# EAGLE design Un_AVR_V2.0 (EAGLE 6.5.0)
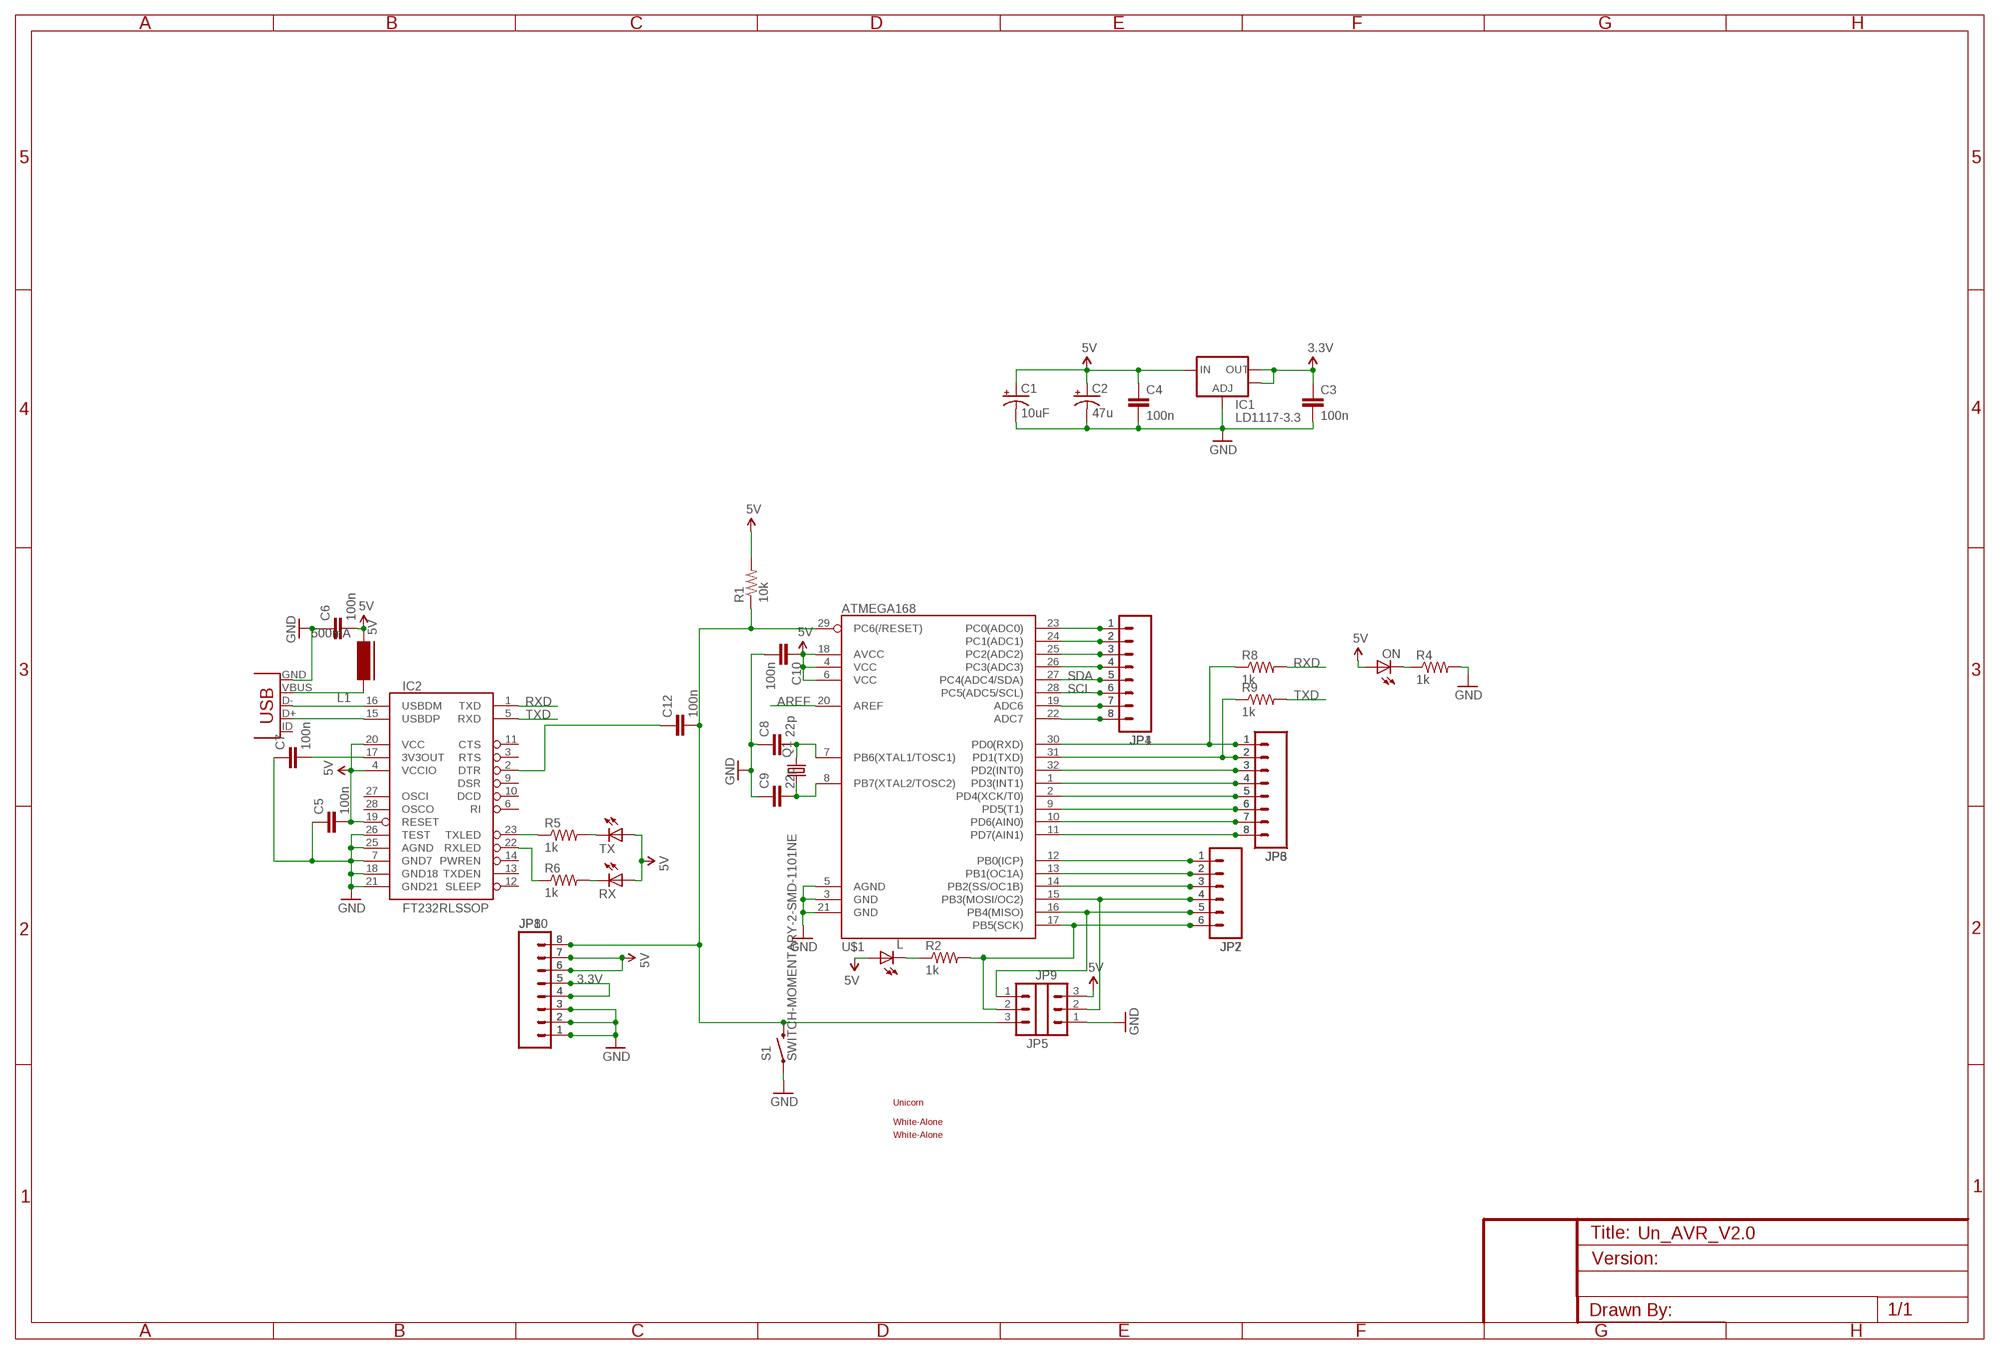
[diagram p0: schematic, sheet 1]

## Parts
C1  10uF  CAP_POL1206  [EIA3216]
C2  47u  CAP_POLD  [PANASONIC_D]
C3  100n  CAP0603-CAP  [0603-CAP]
C4  100n  CAP0603-CAP  [0603-CAP]
C5  100n  CAP0603-CAP  [0603-CAP]
C6  100n  CAP0603-CAP  [0603-CAP]
C7  100n  CAP0603-CAP  [0603-CAP]
C8  22p  CAP0603-CAP  [0603-CAP]
C9  22p  CAP0603-CAP  [0603-CAP]
C10  100n  CAP0603-CAP  [0603-CAP]
C12  100n  CAP0603-CAP  [0603-CAP]
IC1  LD1117-3.3  V_REG_LM1117SOT223  [SOT223]
IC2  FT232RLSSOP  [SSOP28DB]
JP1  M081X08  [1X08]
JP2  M06SIP  [1X06]
JP3  M08  [1X08]
JP4  M081X08  [1X08]
JP5  M03PTH  [1X03]
JP6  M08  [1X08]
JP7  M06SIP  [1X06]
JP8  M08  [1X08]
JP9  M03PTH  [1X03]
JP10  M08  [1X08]
L  LED0805  [LED-0805]
L1  500mA  FERRITE-0805  [FB805]
ON  LED0805  [LED-0805]
Q1  CRYSTALHC49US  [HC49US]
R1  10k  RESISTOR0603-RES  [0603-RES]
R2  1k  RESISTOR0603-RES  [0603-RES]
R4  1k  RESISTOR0603-RES  [0603-RES]
R5  1k  RESISTOR0603-RES  [0603-RES]
R6  1k  RESISTOR0603-RES  [0603-RES]
R8  1k  RESISTOR0603-RES  [0603-RES]
R9  1k  RESISTOR0603-RES  [0603-RES]
RX  LED0805  [LED-0805]
S1  SWITCH-MOMENTARY-2-SMD-1101NE  [TACTILE-SWITCH-1101NE]
TX  LED0805  [LED-0805]
U$1  ATMEGA168  [TQFP32-08]
U$4  UNICORN_1  [UNICORN_1]
U$13  WHITE-ALONE_0  [WHITE-ALONE_0]
U$14  WHITE-ALONE_0  [WHITE-ALONE_0]
U$16  USB_5-SMD  [USB-MINIB]

## Nets
3.3V: C3.1 IC1.2(OUT) IC1.4(OUT) JP8.4 JP8.5 JP10.4 JP10.5
5V: C1.A(+) C2.+ C4.1 C5.2 C6.2 C10.1 IC1.3(IN) IC2.4(VCCIO) IC2.19(RESET) IC2.20(VCC) JP8.6 JP8.7 JP9.3 JP10.6 JP10.7 L1.2 L.1(A) ON.1(A) R1.2 RX.1(A) TX.1(A) U$1.4(VCC) U$1.6(VCC) U$1.18(AVCC)
A0: JP1.1 JP4.1 U$1.23(PC0(ADC0))
AREF: U$1.20(AREF)
GND: C1.C(-) C2.- C3.2 C4.2 C5.1 C6.1 C7.1 C8.1 C9.1 C10.2 IC1.1(ADJ) IC2.7(GND7) IC2.18(GND18) IC2.21(GND21) IC2.25(AGND) IC2.26(TEST) JP8.1 JP8.2 JP8.3 JP9.1 JP10.1 JP10.2 JP10.3 R4.2 S1.P$1 U$1.3(GND) U$1.5(AGND) U$1.21(GND) U$16.GND
IO0: JP3.1 JP6.1 R8.1 U$1.30(PD0(RXD))
N$1: C7.2 IC2.17(3V3OUT)
N$2: IC2.23(TXLED) R5.1
N$3: L1.1 U$16.VBUS
N$4: R5.2 TX.2(C)
N$5: IC2.16(USBDM) U$16.D-
N$6: IC2.15(USBDP) U$16.D+
N$7: R6.2 RX.2(C)
N$8: ON.2(C) R4.1
N$9: L.2(C) R2.1
N$10: IC2.22(RXLED) R6.1
N$12: JP1.7 JP4.7 U$1.19(ADC6)
N$13: JP1.8 JP4.8 U$1.22(ADC7)
N$14: C12.2 JP5.3 JP8.8 JP10.8 R1.1 S1.P$2 U$1.29(PC6(/RESET))
N$15: C12.1 IC2.2(DTR)
N$16: JP2.1 JP7.1 U$1.12(PB0(ICP))
N$17: JP2.2 JP7.2 U$1.13(PB1(OC1A))
N$18: JP2.3 JP7.3 U$1.14(PB2(SS/OC1B))
N$19: JP2.4 JP7.4 JP9.2 U$1.15(PB3(MOSI/OC2))
N$20: JP2.5 JP5.1 JP7.5 U$1.16(PB4(MISO))
N$23: JP3.2 JP6.2 R9.1 U$1.31(PD1(TXD))
N$24: JP3.3 JP6.3 U$1.32(PD2(INT0))
N$25: JP3.4 JP6.4 U$1.1(PD3(INT1))
N$26: JP3.5 JP6.5 U$1.2(PD4(XCK/T0))
N$27: JP3.6 JP6.6 U$1.9(PD5(T1))
N$28: JP3.7 JP6.7 U$1.10(PD6(AIN0))
N$29: JP3.8 JP6.8 U$1.11(PD7(AIN1))
N$31: JP1.2 JP4.2 U$1.24(PC1(ADC1))
N$32: JP1.3 JP4.3 U$1.25(PC2(ADC2))
N$33: JP1.4 JP4.4 U$1.26(PC3(ADC3))
N$39: C8.2 Q1.2 U$1.7(PB6(XTAL1/TOSC1))
N$40: C9.2 Q1.1 U$1.8(PB7(XTAL2/TOSC2))
RXD: IC2.1(TXD) R8.2
SCK: JP2.6 JP5.2 JP7.6 R2.2 U$1.17(PB5(SCK))
SCL: JP1.6 JP4.6 U$1.28(PC5(ADC5/SCL))
SDA: JP1.5 JP4.5 U$1.27(PC4(ADC4/SDA))
TXD: IC2.5(RXD) R9.2
Unconnected: IC2.3(RTS) IC2.6(RI) IC2.9(DSR) IC2.10(DCD) IC2.11(CTS) IC2.12(SLEEP) IC2.13(TXDEN) IC2.14(PWREN) IC2.27(OSCI) IC2.28(OSCO) U$16.ID(USBID)

## Library data of the parts
C1 C2 = 2SparkFun:CAP_POL: Capacitor Polarized These are standard SMD and PTH capacitors. Normally 10uF, 47uF, and 100uF in electrolytic and tantalum varieties. Always verify the external diameter of the through hole cap, it varies with capacity, voltage, and manufacturer. The EIA devices should be standard.
C3-C10 = 2SparkFun:CAP: Capacitor Standard 0603 ceramic capacitor, and 0.1" leaded capacitor.
C12 = 1SparkFun:CAP: Capacitor Standard 0603 ceramic capacitor, and 0.1" leaded capacitor.
IC1 = 1SparkFun:V_REG_LM1117: Voltage Regulator LM1117 Standard adjustable voltage regulator but in SMD form. Spark Fun Electronics SKU : COM-00595
IC2 = 1SparkFun:FT232RL: USB UART FT232RL 4th Generation USB UART (USB <-> Serial) Controller. Spark Fun Electronics SKU : COM-00650
JP1 JP4 = 2SparkFun:M08: Header 8 Standard 8-pin 0.1" header. Use with straight break away headers (SKU : PRT-00116), right angle break away headers (PRT-00553), swiss pins (PRT-00743), machine pins (PRT-00117), and female headers (PRT-00115).
JP2 JP7 = 2SparkFun:M06: Header 6 Standard 6-pin 0.1" header. Use with straight break away headers (SKU : PRT-00116), right angle break away headers (PRT-00553), swiss pins (PRT-00743), machine pins (PRT-00117), and female headers (PRT-00115). Molex polarized connector foot print use with SKU : PRT-08094 with associated crimp pins and housings. NOTES ON THE VARIANTS LOCK and LOCK_LONGPADS... This footprint was designed to help hold the alignment of a through-hole component (i.e. 6-pin header) while soldering it into place. You may notice that each hole has been shifted either up or down by 0.005 of an inch from it's more standard position (which is a perfectly straight line). This slight alteration caused the pins (the squares in the middle) to touch the edges of the holes. Because they are alternating, it causes a "brace" to hold the component in place. 0.005 has proven to be the perfect amount of "off-center" position when using our standard breakaway headers. Although looks a little odd when you look at the bare footprint, once you have a header in there, the alteration is very hard to notice. Also, if you push a header all the way into place, it is covered up entirely on the bottom side. This idea of altering the position of holes to aid alignment will be further integrated into the Sparkfun Library for other footprints. It can help hold any component with 3 or more connection pins.
JP3 JP6 JP8 JP10 = 1SparkFun:M08: Header 8 Standard 8-pin 0.1" header. Use with straight break away headers (SKU : PRT-00116), right angle break away headers (PRT-00553), swiss pins (PRT-00743), machine pins (PRT-00117), and female headers (PRT-00115).
JP5 JP9 = 0SparkFun:M03: Header 3 Standard 3-pin 0.1" header. Use with straight break away headers (SKU : PRT-00116), right angle break away headers (PRT-00553), swiss pins (PRT-00743), machine pins (PRT-00117), and female headers (PRT-00115). Molex polarized connector foot print use with SKU : PRT-08232 with associated crimp pins and housings.
L ON RX TX = 1SparkFun:LED: LEDs Standard schematic elements and footprints for 5mm, 3mm, 1206, and 0603 sized LEDs. 5mm - Spark Fun Electronics SKU : COM-00529 (and others)
L1 = 2SparkFun:FERRITE: Ferrite bead in various packages
Q1 = 1SparkFun:CRYSTAL: Crystals Various standard crystals. Proven footprints. Spark Fun Electronics SKU : COM-00534
R1 R2 R4-R6 R8 R9 = 2SparkFun:RESISTOR: Resistor Basic schematic elements and footprints for 0603, 1206, and PTH resistors.
S1 = 2SparkFun:SWITCH-MOMENTARY-2
U$1 = 1SparkFun:ATMEGA168
U$4 = 2SparkFun:UNICORN
U$13 U$14 = 2SparkFun:WHITE-ALONE
U$16 = 2SparkFun:USB_5

## Net classes
0 default: width 0.254 mm, clearance 0.254 mm
1 power: width 0.61 mm, drill 0.61 mm, clearance 0.254 mm
2 gnd: width 0.305 mm, drill 0.559 mm, clearance 0.254 mm
3 usbvcc: width 0.508 mm, drill 0.61 mm, clearance 0.254 mm
4 aref: width 0.406 mm, drill 0.61 mm, clearance 0.254 mm

## Board
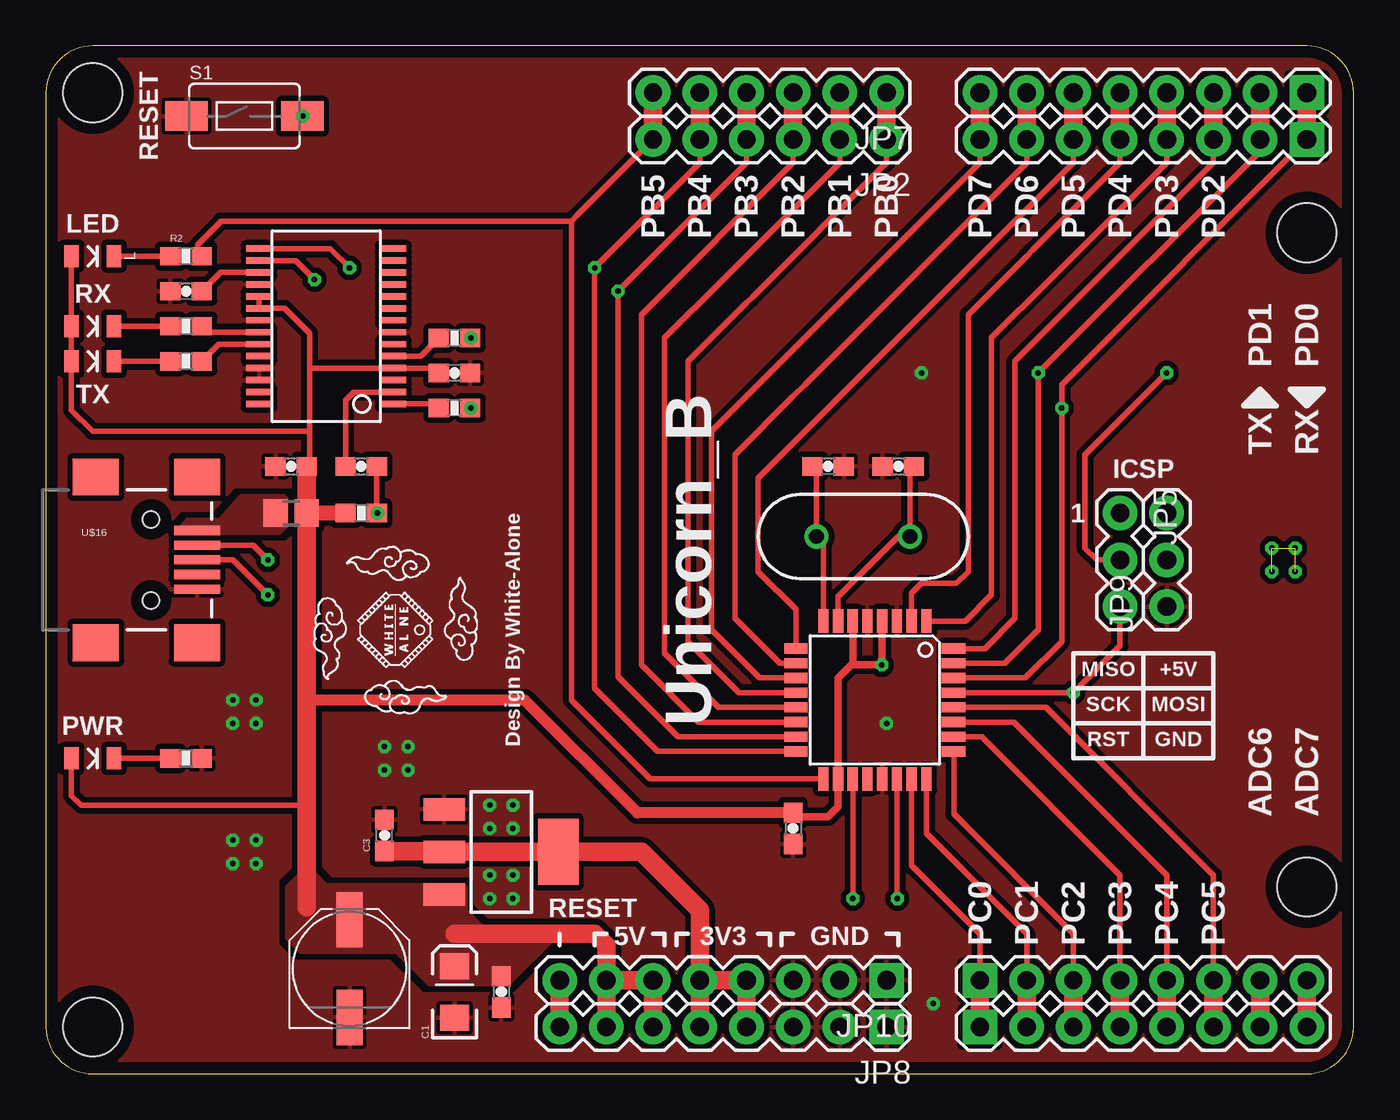
[diagram p1: board, top side]
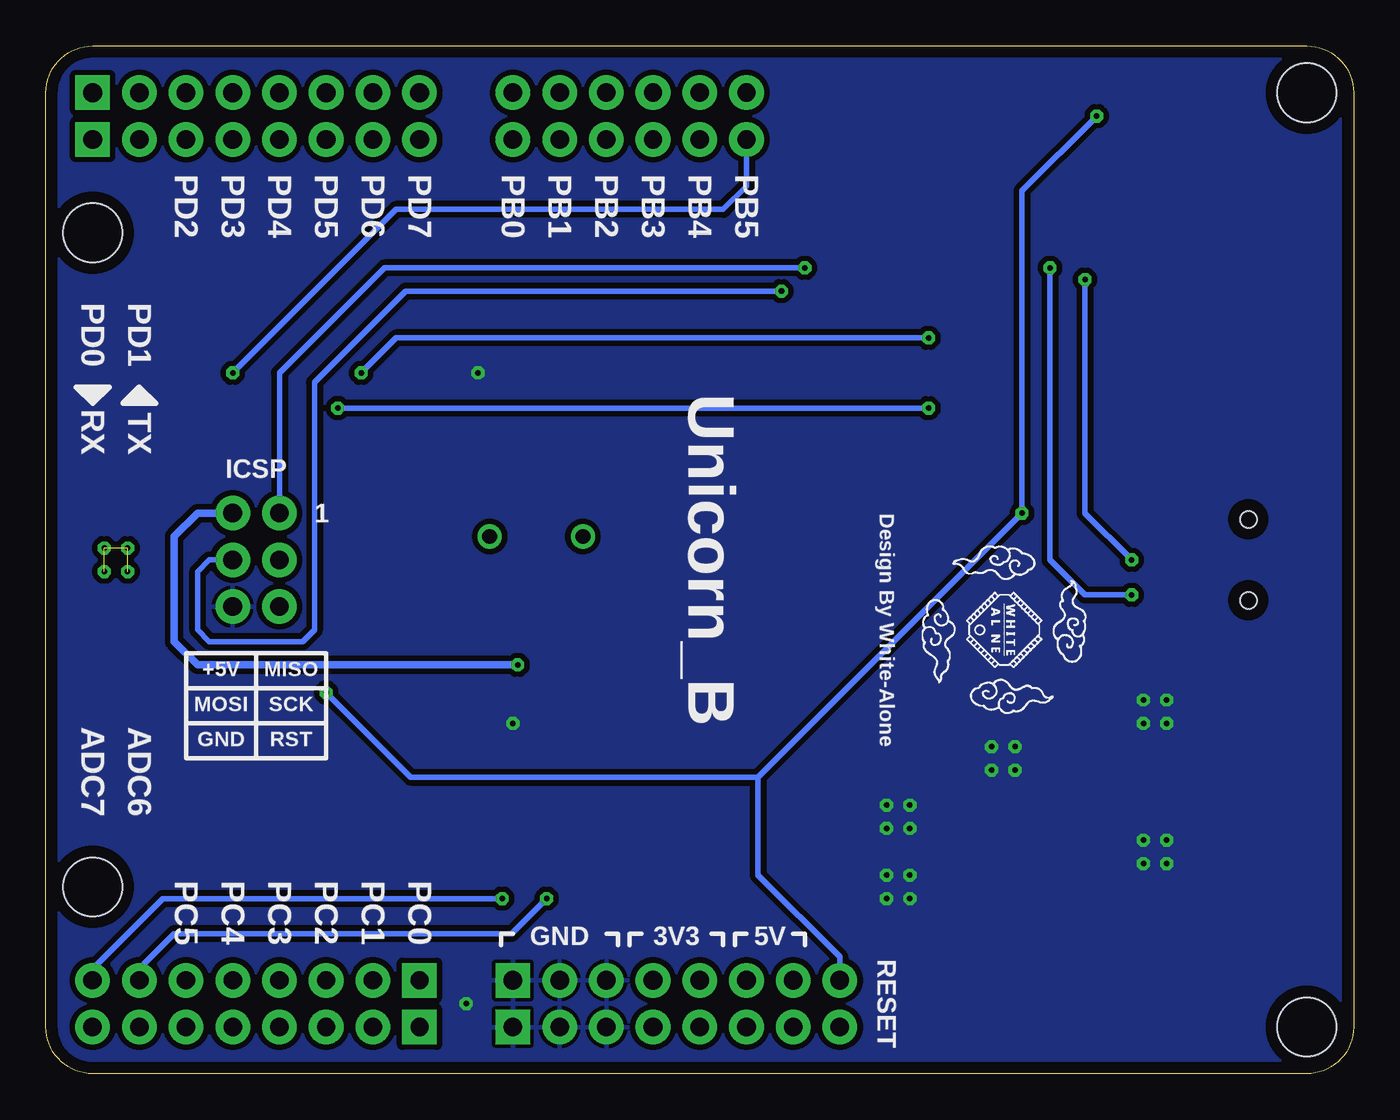
[diagram p2: board, bottom side, seen from below]

Size 71.12 x 55.88 mm. Coordinates in mm from the lower left corner, seen from the top.
Copper layers (1*16): Top 0.035mm / dielectric 1.5mm / Bottom 0.035mm
Design rules "yun": minimum track width 8mil, minimum drill 15mil, track to track 8mil, track to pad 8mil, pad to pad 8mil, via to via 8mil, smd to smd 8mil, copper to edge 25mil, drill to drill 8mil, minimum pad ring 10mil, minimum via ring 8mil, stop-mask expansion 4mil, vias tented up to drill 20mil, thermal gap 8mil

### Footprints (pad centres in the part's own frame; a part is rotated, then mirrored left to right if it is on the bottom)
EIA3216 = smd 1.4 x 1.6: A 1.4,0; C -1.4,0
PANASONIC_D = smd 3 x 1.4: + 2.654,0; - -2.654,0
0603-CAP = smd 1.1 x 1: 1 -0.85,0; 2 0.85,0
SOT223 = smd 1.219 x 2.235: 1 -2.311,-3.099; 2 0,-3.099; 3 2.311,-3.099 | smd 3.6 x 2.2: 4 0,3.099
SSOP28DB = smd 0.348 x 1.397: 1 -4.225,-3.656; 2 -3.575,-3.656; 3 -2.925,-3.656; 4 -2.275,-3.656; 5 -1.625,-3.656; 6 -0.975,-3.656; 7 -0.325,-3.656; 8 0.325,-3.656; 9 0.975,-3.656; 10 1.625,-3.656; 11 2.275,-3.656; 12 2.925,-3.656; 13 3.575,-3.656; 14 4.225,-3.656; 15 4.225,3.656; 16 3.575,3.656; 17 2.925,3.656; 18 2.275,3.656; 19 1.625,3.656; 20 0.975,3.656; 21 0.325,3.656; 22 -0.325,3.656; 23 -0.975,3.656; 24 -1.625,3.656; 25 -2.275,3.656; 26 -2.925,3.656; 27 -3.575,3.656; 28 -4.225,3.656
1X08 = drill 1 pad 1.88 square: 1 0,0 | drill 1 pad 1.88: 2 2.54,0; 3 5.08,0; 4 7.62,0; 5 10.16,0; 6 12.7,0; 7 15.24,0; 8 17.78,0
1X06 = drill 1 pad 1.88: 1 0,0; 2 2.54,0; 3 5.08,0; 4 7.62,0; 5 10.16,0; 6 12.7,0
1X08' = drill 1.016 pad 1.88 square: 1 0,0 | drill 1.016 pad 1.88: 2 2.54,0; 3 5.08,0; 4 7.62,0; 5 10.16,0; 6 12.7,0; 7 15.24,0; 8 17.78,0
1X03 = drill 1.016 pad 1.88: 1 0,0; 2 2.54,0; 3 5.08,0
LED-0805 = smd 0.8 x 1.2: 1 -1.154,0; 2 1.154,0
FB805 = smd 1.3 x 1.5: 1 -0.85,0; 2 0.85,0
HC49US = drill 0.813: 1 -2.54,0; 2 2.54,0
0603-RES = smd 1.1 x 1: 1 -0.85,0; 2 0.85,0
TACTILE-SWITCH-1101NE = smd 2.3 x 1.6: P$1 -3.15,0; P$2 3.15,0
TQFP32-08 = smd 1.27 x 0.559: 1 -4.293,2.8; 2 -4.293,2; 3 -4.293,1.2; 4 -4.293,0.4; 5 -4.293,-0.4; 6 -4.293,-1.2; 7 -4.293,-2; 8 -4.293,-2.8; 17 4.293,-2.8; 18 4.293,-2; 19 4.293,-1.2; 20 4.293,-0.4; 21 4.293,0.4; 22 4.293,1.2; 23 4.293,2; 24 4.293,2.8 | smd 0.559 x 1.27: 9 -2.8,-4.293; 10 -2,-4.293; 11 -1.2,-4.293; 12 -0.4,-4.293; 13 0.4,-4.293; 14 1.2,-4.293; 15 2,-4.293; 16 2.8,-4.293; 25 2.8,4.293; 26 2,4.293; 27 1.2,4.293; 28 0.4,4.293; 29 -0.4,4.293; 30 -1.2,4.293; 31 -2,4.293; 32 -2.8,4.293
UNICORN_1 = hole 3.2: -33.02,-25.4; 33.02,17.78; 33.02,-17.78; -33.02,25.4
USB-MINIB = smd 2.5 x 0.5: D+ 2.5,0; D- 2.5,0.8; GND 2.5,-1.6; ID 2.5,-0.8; VBUS 2.5,1.6 | smd 2.5 x 2: MTN1 -3,4.5; MTN2 2.5,4.5; MTN3 -3,-4.5; MTN4 2.5,-4.5 | hole 0.9: 0,2.2; 0,-2.2

### Placement (x,y rotation side)
C1  22.23,4.45 90 top
C2  16.51,5.71 90 top
C3  18.41,12.95 90 top
C4  24.77,4.45 270 top
C5  22.23,38.1 180 top
C6  13.34,33.02 0 top
C7  7.62,42.55 0 top
C8  46.35,33.02 0 top
C9  42.55,33.02 180 top
C10  40.64,13.34 270 top
C12  17.14,33.02 0 top
IC1  24.77,12.06 270 top
IC2  15.24,40.64 90 top
JP1  50.8,5.08 0 top
JP2  45.72,50.8 180 top
JP3  [1X08']  68.58,53.34 180 top
JP4  50.8,2.54 0 top
JP5  58.42,30.48 270 top
JP6  [1X08']  68.58,50.8 180 top
JP7  45.72,53.34 180 top
JP8  [1X08']  45.72,2.54 180 top
JP9  60.96,25.4 90 top
JP10  [1X08']  45.72,5.08 180 top
L  2.54,44.45 0 top
L1  13.34,30.48 0 top
ON  2.54,17.14 0 top
Q1  44.45,29.21 0 top
R1  17.14,30.48 180 top
R2  7.62,44.45 0 top
R4  7.62,17.14 0 top
R5  7.62,38.73 180 top
R6  7.62,40.64 180 top
R8  22.23,36.2 180 top
R9  22.23,40.01 180 top
RX  2.54,40.64 0 top
S1  10.79,52.07 0 top
TX  2.54,38.73 0 top
U$1  45.09,20.32 270 top
U$4  35.56,27.94 0 top
U$13  19.05,24.13 90 top
U$14  19.05,24.13 270 bottom
U$16  5.71,27.94 0 top

### Tracks (layer width: path | path; a pad name or v marks a point on that pad's centre or on a via)
3.3V
  Top 1.016: C3.1 22.26,12.1 IC1.2 IC1.4 32.38,12.06 35.56,8.89 JP10.5 | JP8.5 JP10.5 | JP8.4 JP10.4 JP10.5
5V  (via drill 0.3)
  Top 0.305: 45.47,24.64 45.47,24.51 45.48,24.53 U$1.4 | C6.2 14.34,33.17 14.34,34.92 | IC2.19 IC2.20 12.99,41.62 14.34,40.27 14.34,38.37 | ON.1 1.39,15.12 1.91,14.61 14.19,14.61 | L.1 RX.1 TX.1 1.39,36.08 2.54,34.92 14.34,34.92 | 14.34,34.92 14.34,38.37 | 14.34,38.37 IC2.4 21.11,38.37 C5.2
  Top 0.406: 45.47,24.51 v45.47,22.23 43.81,22.23 | 43.81,22.23 43.09,21.5 U$1.18 43.09,14.51 42.55,13.97 40.85,13.97 C10.1 | U$1.6 43.88,22.3 43.81,22.23
  Top 0.61: 14.19,20.32 26.04,20.32 32.17,14.19 C10.1
  Top 0.813: R1.2 L1.2
  Top 1.016: C6.2 L1.2 14.19,20.32 14.19,14.61 14.19,9.06 | JP8.6 JP10.6 JP10.7 | JP10.7 JP8.7 | JP10.7 30.48,6.99 29.84,7.62 22.23,7.62
  Bottom 0.406: v45.47,22.23 62.87,22.23 64.14,23.5 64.14,29.21 62.87,30.48 JP9.3
  pour Top (no thermals): 13.08,7.37 13.84,6.6 19.05,6.6 20.83,4.83 25.15,4.83 27.81,7.49 27.81,8 23.75,8 22.86,8.89 22.86,10.16 22.73,10.29 15.24,10.29 14.61,10.92 13.84,10.92 13.08,10.16
A0
  Top 0.305: U$1.23 47.09,11.34 50.8,7.62 JP1.1
  Top 1.016: JP1.1 JP4.1
GND  (via drill 0.3)
  other vias: 45.72,19.05 48.26,3.81 24.13,10.79 25.4,10.79 25.4,13.34 25.4,14.61 10.16,20.32 11.43,20.32 11.43,19.05 10.16,19.05 18.41,16.51 19.68,16.51 19.68,17.78 18.41,17.78 10.16,12.7 11.43,12.7 10.16,11.43 11.43,11.43 24.13,9.53 25.4,9.53 24.13,13.34 24.13,14.61 47.62,38.1
  pour Top (isolate 0.305, rank 2): 0,55.88 71.12,55.88 71.12,0 0,0
  pour Bottom (isolate 0.305, rank 2): 0,55.88 71.12,55.88 71.12,0 0,0
GND1  (via drill 0.3)  (3 unrouted)
  other vias: 66.67,27.3 67.94,27.3 67.94,28.57 66.67,28.57
IO0  (via drill 0.3)
  Top 0.305: R8.1 v23.11,36.2 | JP6.1 55.24,37.47 v55.24,36.2 55.24,23.5 53.27,21.52 U$1.30
  Top 1.016: JP3.1 JP6.1
  Bottom 0.305: v23.11,36.2 v55.24,36.2
N$1
  Top 0.305: IC2.17 9.49,43.56 C7.2
N$2
  Top 0.305: IC2.23 9.4,39.66 R5.1
N$3
  pour Top (no thermals): 7.42,29.39 12.7,29.39 13.08,29.77 13.08,31.29 12.95,31.42 10.59,31.42 9.45,30.15 7.67,30.15 7.29,29.72 7.29,29.46
N$4
  Top 0.305: TX.2 R5.2
N$5  (via drill 0.3)
  Top 0.305: IC2.16 13.57,44.22 v14.61,43.18 | v12.06,27.94 11.27,28.74 U$16.D-
  Bottom 0.305: v14.61,43.18 14.61,30.48 v12.06,27.94
N$6  (via drill 0.3)
  Top 0.305: U$16.D+ 10.16,27.94 v12.06,26.04 | IC2.15 15.46,44.87 v16.51,43.81
  Bottom 0.305: v16.51,43.81 16.51,27.94 14.61,26.04 v12.06,26.04
N$7
  Top 0.305: RX.2 R6.2
N$8
  Top 0.305: ON.2 R4.1
N$9
  Top 0.305: L.2 R2.1
N$10
  Top 0.305: IC2.22 8.79,40.31 R6.1
N$12  (via drill 0.3)
  Top 0.305: U$1.19 v43.88,9.53 v43.89,9.53
  Top 1.016: JP1.7 JP4.7
  Bottom 0.305: v43.89,9.53 45.8,7.62 64.14,7.62 66.04,5.71 JP1.7
N$13  (via drill 0.3)
  Top 0.305: U$1.22 46.28,9.54 v46.3,9.53
  Top 1.016: JP1.8 JP4.8
  Bottom 0.305: v46.3,9.53 64.77,9.53 68.58,5.71 JP1.8
N$14  (via drill 0.3)
  Top 0.305: C12.2 R1.1 v18.03,30.48 | U$1.29 v55.88,20.72 58.42,23.26 JP5.3 | S1.P$2 v13.97,52.07
  Top 1.016: JP8.8 JP10.8
  Bottom 0.305: JP10.8 27.94,6.35 32.38,10.79 32.38,16.13 | 32.38,16.13 v18.03,30.48 18.03,48.01 v13.97,52.07 | v55.88,20.72 51.29,16.13 32.38,16.13
N$15
  Top 0.305: C12.1 16.3,36.62 16.75,37.06 IC2.2
N$16
  Top 0.305: 40.88,20.72 U$1.12 37.7,20.72 34.92,23.5 34.92,38.73 38.1,41.91 38.42,42.23 45.72,49.53 JP2.1
  Top 1.016: JP7.1 JP2.1
N$17
  Top 0.305: U$1.13 40.77,19.94 36.58,19.94 33.66,22.86 33.66,40.01 36.83,43.18 37.15,43.5 43.18,49.53 JP2.2
  Top 1.016: JP7.2 JP2.2
N$18
  Top 0.305: JP2.3 40.64,49.53 32.38,41.27 32.38,22.23 35.49,19.12 U$1.14
  Top 1.016: JP7.3 JP2.3
N$19  (via drill 0.3)
  Top 0.305: JP2.4 38.1,49.53 v31.11,42.55 31.11,21.59 34.38,18.32 U$1.15
  Top 1.016: JP7.4 JP2.4
  Bottom 0.305: v31.11,42.55 51.55,42.56 56.52,37.59 56.52,24.13 57.15,23.5 62.23,23.5 62.87,24.13 62.87,27.3 62.23,27.94 JP9.2
N$20  (via drill 0.3)
  Top 0.305: 40.79,17.5 40.77,17.53 33.27,17.53 29.84,20.95 v29.84,43.81 35.56,49.53 JP2.5 | U$1.16 40.79,17.5 | 40.79,17.5 40.89,17.4
  Top 1.016: JP7.5 JP2.5
  Bottom 0.305: v29.84,43.81 52.7,43.81 58.42,38.1 JP5.1
N$23  (via drill 0.3)
  Top 0.305: R9.1 v23.11,40.01 | JP6.2 66.04,50.16 v53.98,38.1 53.98,24.13 52.16,22.32 U$1.31
  Top 1.016: JP3.2 JP6.2
  Bottom 0.305: v23.11,40.01 52.07,40.01 v53.98,38.1
N$24
  Top 0.305: U$1.32 51.06,23.12 52.7,24.77 52.7,38.73 63.5,49.53 JP6.3
  Top 1.016: JP3.3 JP6.3
N$25
  Top 0.305: U$1.1 50.01,24.61 51.44,26.04 51.44,40.01 54.61,43.18 54.93,43.5 60.96,49.53 JP6.4
  Top 1.016: JP3.4 JP6.4
N$26
  Top 0.305: JP6.5 58.42,49.53 53.66,44.77 53.34,44.45 50.16,41.27 50.16,27.3 49.53,26.67 47.62,26.67 47.09,26.13 U$1.2
  Top 1.016: JP3.5 JP6.5
N$27
  Top 0.305: U$1.9 40.79,25.25 38.73,27.3 38.73,32.38 55.88,49.53 JP6.6
  Top 1.016: JP3.6 JP6.6
N$28
  Top 0.305: JP6.7 53.34,49.53 41.27,37.47 40.64,36.83 37.47,33.66 37.47,24.77 39.91,22.32 U$1.10
  Top 1.016: JP3.7 JP6.7
N$29
  Top 0.305: JP6.8 50.8,49.53 36.2,34.92 36.2,24.13 38.8,21.52 U$1.11
  Top 1.016: JP3.8 JP6.8
N$31
  Top 0.305: U$1.24 47.88,13.07 53.34,7.62 JP1.2
  Top 1.016: JP4.2 JP1.2
N$32
  Top 0.305: U$1.25 49.38,14.12 55.88,7.62 JP1.3
  Top 1.016: JP1.3 JP4.3
N$33
  Top 0.305: U$1.26 50.9,18.32 58.42,10.79 JP1.4
  Top 1.016: JP4.4 JP1.4
N$39
  Top 0.305: C8.2 46.99,32.8 Q1.2 46.35,29.21 43.09,25.94 U$1.7
N$40
  Top 0.305: C9.2 41.91,32.8 Q1.1 42.28,28.84 U$1.8
RXD
  Top 0.305: IC2.1 21.16,36.41 R8.2
SCK  (via drill 0.3)
  Top 0.305: 42.29,16 42.16,16 42.19,16.03 U$1.17 32.87,16.03 28.57,20.32 28.57,46.35 | JP2.6 28.89,46.67 28.57,46.35 | 28.57,46.35 9.53,46.35 8.26,45.09 8.26,44.66 R2.2 | v60.96,38.1 56.52,33.66 56.52,28.57 57.15,27.94 JP5.2
  Top 1.016: JP7.6 JP2.6
  Bottom 0.305: JP2.6 33.02,48.26 34.29,46.99 52.07,46.99 v60.96,38.1
SCL
  Top 0.305: U$1.28 54.38,19.92 63.5,10.79 JP1.6
  Top 1.016: JP1.6 JP4.6
SDA
  Top 0.305: U$1.27 52.63,19.12 60.96,10.79 JP1.5
  Top 1.016: JP1.5 JP4.5
TXD
  Top 0.305: IC2.5 20.39,39.02 R9.2

### Text on the board
tPlace: RESET | PB5 | PB4 | PB3 | PB2 | PB1 | PB0 | PD7 | PD6 | PD5 | PD4 | PD3 | PD2 | LED | RX | PD1 | PD0 | TX | TX | RX | ICSP | 1 | Unicorn_B | Design By White-Alone | MISO | +5V | SCK | MOSI | PWR | RST | GND | ADC6 | ADC7 | RESET | 5V | 3V3 | GND | PC0 | PC1 | PC2 | PC3 | PC4 | PC5
bPlace: PB5 | PB4 | PB3 | PB2 | PB1 | PB0 | PD7 | PD6 | PD5 | PD4 | PD3 | PD2 | PD1 | PD0 | TX | RX | ICSP | 1 | Unicorn_B | Design By White-Alone | MISO | +5V | SCK | MOSI | RST | GND | ADC6 | ADC7 | 5V | 3V3 | GND | PC0 | PC1 | PC2 | PC3 | PC4 | PC5 | RESET